# EAGLE schematic PoE_Board (EAGLE 7.3.0)
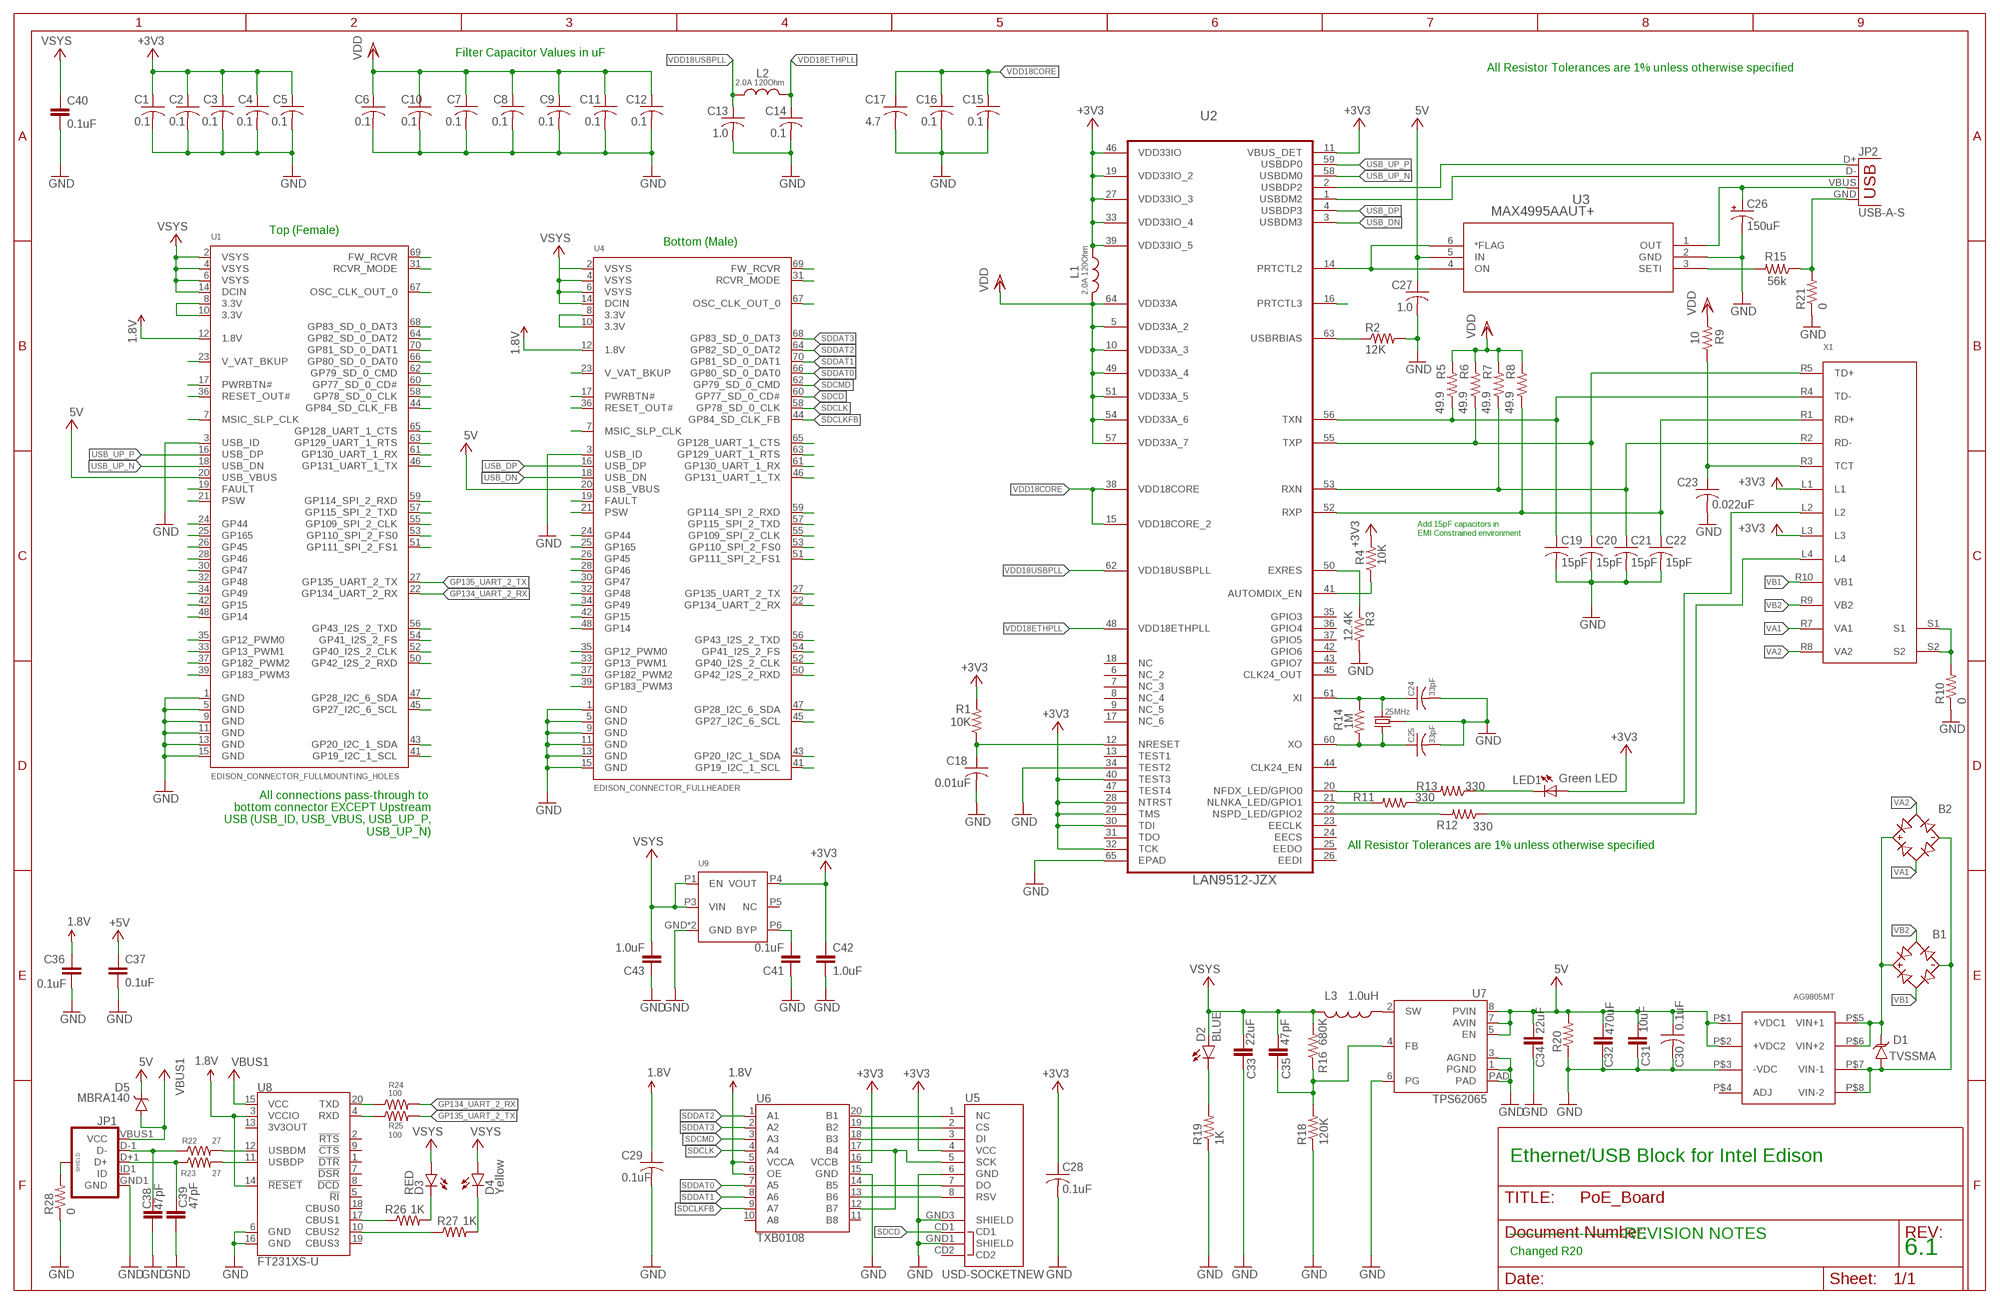
[diagram p0: schematic, sheet 1]

## Parts
AG9805MT  AG9800M  [AG9800M_SMT]
B1  DF1510S  [DFS]
B2  DF1510S  [DFS]
C1  0.1  C-USC0402K  [C0402K]
C2  0.1  C-USC0402K  [C0402K]
C3  0.1  C-USC0402K  [C0402K]
C4  0.1  C-USC0402K  [C0402K]
C5  0.1  C-USC0402K  [C0402K]
C6  0.1  C-USC0402K  [C0402K]
C7  0.1  C-USC0402K  [C0402K]
C8  0.1  C-USC0402K  [C0402K]
C9  0.1  C-USC0402K  [C0402K]
C10  0.1  C-USC0402K  [C0402K]
C11  0.1  C-USC0402K  [C0402K]
C12  0.1  C-USC0402K  [C0402K]
C13  1.0  C-USC0402K  [C0402K]
C14  0.1  C-USC0402K  [C0402K]
C15  0.1  C-USC0402K  [C0402K]
C16  0.1  C-USC0402K  [C0402K]
C17  4.7  C-USC0603K  [C0603K]
C18  0.01uF  C-USC0603K  [C0603K]
C19  15pF  C-USC0402  [C0402]
C20  15pF  C-USC0402  [C0402]
C21  15pF  C-USC0402  [C0402]
C22  15pF  C-USC0402  [C0402]
C23  0.022uF  C-USC0805  [C0805]
C24  33pF  C-USC0402  [C0402]
C25  33pF  C-USC0402  [C0402]
C26  150uF  CAP_POLE  [PANASONIC_E]
C27  1.0  C-USC0402K  [C0402K]
C28  0.1uF  C-USC0402  [C0402]
C29  0.1uF  C-USC0402  [C0402]
C30  0.1uF  C-USC0402  [C0402]
C31  10uF  4.7UF-16V-20%,+80%-(1206)  [1206-CAP]
C32  470uF  F12CAP  [16SVPE470M]
C33  22uF  47PF-50V-5%(0603)  [0603-CAP]
C34  22uF  47PF-50V-5%(0603)  [0603-CAP]
C35  47pF  47PF-50V-5%(0603)  [0603-CAP]
C36  0.1uF  0.1UF-16V(+-10%)(0402)  [0402-CAP]
C37  0.1uF  0.1UF-16V(+-10%)(0402)  [0402-CAP]
C38  47pF  47PF-50V-5%(0603)  [0603-CAP]
C39  47pF  47PF-50V-5%(0603)  [0603-CAP]
C40  0.1uF  0.1UF-16V(+-10%)(0402)  [0402-CAP]
C41  0.1uF  0.1UF-16V(+-10%)(0402)  [0402-CAP]
C42  1.0uF  1.0UF-16V-10%(0402)  [0402-CAP]
C43  1.0uF  1.0UF-16V-10%(0402)  [0402-CAP]
D1  TVSSMA  [SMA-DIODE]
D2  BLUE  LED-BLUE0603  [LED-0603]
D3  RED  LED-RED0603  [LED-0603]
D4  Yellow  LED-YELLOW0603  [LED-0603]
D5  MBRA140  DIODE-SCHOTTKY-MBRA140  [SMA-DIODE]
JP1  USB_MICROB_PLUGCONN-11752  [USB-B-MICRO-SMD_V03]
JP2  USB-A-S  [USB-A-S]
L1  2.0A 120Ohm  L-US0603  [L0603]
L2  2.0A 120Ohm  L-US0603  [L0603]
L3  1.0uH  INDUCTOR1210  [1210]
LED1  Green LED  LEDCHIP-LED0805  [CHIP-LED0805]
R1  10K  R-US_R0603  [R0603]
R2  12K  R-US_R0603  [R0603]
R3  12.4K  R-US_R0603  [R0603]
R4  10K  R-US_R0603  [R0603]
R5  49.9  R-US_R0402  [R0402]
R6  49.9  R-US_R0402  [R0402]
R7  49.9  R-US_R0402  [R0402]
R8  49.9  R-US_R0402  [R0402]
R9  10  R-US_R0402  [R0402]
R10  0  0OHM-1/10W-5%(0603)  [0603]
R11  330  R-US_R0402  [R0402]
R12  330  R-US_R0402  [R0402]
R13  330  R-US_R0402  [R0402]
R14  1M  R-US_R0402  [R0402]
R15  56k  R-US_R0603  [R0603]
R16  680K  RESISTOR0402  [0402-RES]
R18  120K  RESISTOR0402  [0402-RES]
R19  1K  1KOHM-1/10W-1%(0603)  [0603-RES]
R20  24OHM_1225  [R1225]
R21  0  0OHM-1/10W-5%(0603)  [0603]
R22  27  R-US_R0402  [R0402]
R23  27  R-US_R0402  [R0402]
R24  100  R-US_R0402  [R0402]
R25  100  R-US_R0402  [R0402]
R26  1K  R-US_R0402  [R0402]
R27  1K  R-US_R0402  [R0402]
R28  0  0OHM-1/10W-5%(0603)  [0603]
U1  EDISON_CONNECTOR_FULLMOUNTING_HOLES  [EDISON_DAUGHTER]
U2  LAN9512-JZX  [QFN50P900X900X100-65N]
U3  MAX4995AAUT+  [21-0058I]
U4  EDISON_CONNECTOR_FULLHEADER  [DF40C-70DP-0.4(51)]
U5  USD-SOCKETNEW  [MICRO-SD-SOCKET-PP]
U6  TXB0108  [UFDFN-20]
U7  TPS62065  [WSON-8-PAD]
U8  FT231XS-U  FT231XS  [SSOP20_L]
U9  MIC5353-XXYMT  [6-UFDFN]
U$1  25MHz  CRYSTAL-GROUNDED  [CRYSTAL-SMD-5X3]
X1  RB1-125BHQ1A  [RB1-125BHQ1A]

## Nets
1.8V: C29.1 C36.1 U1.12(1.8V) U4.12(1.8V) U6.5(VCCA) U6.6(OE) U8.3(VCCIO) U8.14(!RESET)
5V: AG9805MT.P$1(+VDC1) AG9805MT.P$2(+VDC2) C30.1 C31.1 C32.1 C34.1 R20.P$2 U7.5(EN) U7.7(AVIN) U7.8(PVIN)
+3V3: C1.1 C2.1 C3.1 C4.1 C5.1 C28.1 C42.1 L1.1 LED1.A R1.2 R4.2 U2.11(VBUS_DET) U2.19(VDD33IO_2) U2.27(VDD33IO_3) U2.28(NTRST) U2.29(TMS) U2.30(TDI) U2.32(TCK) U2.33(VDD33IO_4) U2.39(VDD33IO_5) U2.40(TEST3) U2.46(VDD33IO) U5.4(VCC) U6.16(VCCB) U9.P4(VOUT) X1.L1 X1.L3
+5V: C27.1 C37.1 D5.C U1.20(USB_VBUS) U3.5(IN) U4.20(USB_VBUS) ; supply symbol labelled 5V
CHASSGND: R10.2 X1.S1 X1.S2
DSUSB_N: JP2.D- U2.1(USBDM2)
DSUSB_P: JP2.D+ U2.2(USBDP2)
ED3.3V: U1.8(3.3V) U1.10(3.3V) U4.8(3.3V) U4.10(3.3V)
GND: AG9805MT.P$3(-VDC) C1.2 C2.2 C3.2 C4.2 C5.2 C6.2 C7.2 C8.2 C9.2 C10.2 C11.2 C12.2 C13.2 C14.2 C15.2 C16.2 C17.2 C18.2 C19.2 C20.2 C21.2 C22.2 C23.2 C24.2 C25.2 C26.- C27.2 C28.2 C29.2 C30.2 C31.2 C32.2 C33.2 C34.2 C36.2 C37.2 C38.2 C39.2 C40.2 C41.1 C42.2 C43.1 JP1.GND1(GND) R2.2 R3.2 R10.1 R18.1 R19.1 R20.P$1 R21.1 R28.1 U1.1(GND) U1.3(USB_ID) U1.5(GND) U1.9(GND) U1.11(GND) U1.13(GND) U1.15(GND) U2.34(TEST2) U2.65(EPAD) U3.2(GND) U4.1(GND) U4.3(USB_ID) U4.5(GND) U4.9(GND) U4.11(GND) U4.13(GND) U4.15(GND) U5.6(GND) U5.GND1(SHIELD) U5.GND3(SHIELD) U6.15(GND) U7.1(PGND) U7.3(AGND) U7.6(PG) U7.PAD U8.6(GND) U8.16(GND) U9.GND U9.P2(GND) U$1.2 U$1.4
GP134_UART_2_RX: R24.2 U1.22(GP134_UART_2_RX) U4.22(GP134_UART_2_RX)
GP135_UART_2_TX: R25.2 U1.27(GP135_UART_2_TX) U4.27(GP135_UART_2_TX)
N$2: U5.1(NC) U6.20(B1)
N$3: U2.16(PRTCTL3)
N$4: U5.2(CS) U6.19(B2)
N$5: U5.3(DI) U6.18(B3)
N$6: R2.1 U2.63(USBRBIAS)
N$7: C18.1 R1.1 U2.12(NRESET)
N$8: R3.1 U2.50(EXRES)
N$9: R4.1 U2.41(AUTOMDIX_EN)
N$10: C23.1 R9.1 X1.R3(TCT)
N$11: U5.5(SCK) U6.12(B7) U6.17(B4)
N$12: U5.7(DO) U6.14(B5)
N$13: U5.8(RSV) U6.13(B6)
N$14: L3.1 U7.2(SW)
N$15: R11.2 U2.21(NLNKA_LED/GPIO1)
N$16: R11.1 X1.L2
N$17: R12.1 X1.L4
N$18: R12.2 U2.22(NSPD_LED/GPIO2)
N$19: LED1.C R13.1
N$20: R13.2 U2.20(NFDX_LED/GPIO0)
N$21: C24.1 R14.1 U2.61(XI) U$1.1
N$22: C25.1 R14.2 U2.60(XO) U$1.3
N$23: U2.14(PRTCTL2) U3.4(ON) U3.6(*FLAG)
N$24: AG9805MT.P$5(VIN+1) AG9805MT.P$6(VIN+2) B1.+ B2.+ D1.C
N$25: C26.+ JP2.VBUS U3.1(OUT)
N$26: R15.2 U3.3(SETI)
N$27: D2.C R19.2
N$28: JP2.GND R15.1 R21.2
N$29: C38.1 JP1.D-1(D-) R22.1
N$30: C39.1 JP1.D+1(D+) R23.1
N$31: R22.2 U8.12(USBDM)
N$32: JP1.SHIELD1(SHIELD) JP1.SHIELD2(SHIELD) JP1.SHIELD3(SHIELD) R28.2
N$33: AG9805MT.P$7(VIN-1) AG9805MT.P$8(VIN-2) B1.- B2.- D1.A
N$34: R23.2 U8.11(USBDP)
N$35: R24.1 U8.20(TXD)
N$36: R25.1 U8.4(RXD)
N$37: C35.2 R16.1 R18.2 U7.4(FB)
N$38: C41.2 U9.P6(BYP)
N$39: R27.1 U8.10(CBUS2)
N$40: R26.1 U8.17(CBUS1)
N$41: D3.C R26.2
N$42: D4.C R27.2
P7: U1.7(MSIC_SLP_CLK) U4.7(MSIC_SLP_CLK)
P17: U1.17(PWRBTN#) U4.17(PWRBTN#)
P19: U1.19(FAULT) U4.19(FAULT)
P21: U1.21(PSW) U4.21(PSW)
P23: U1.23(V_VAT_BKUP) U4.23(V_VAT_BKUP)
P24: U1.24(GP44) U4.24(GP44)
P25: U1.25(GP165) U4.25(GP165)
P26: U1.26(GP45) U4.26(GP45)
P28: U1.28(GP46) U4.28(GP46)
P30: U1.30(GP47) U4.30(GP47)
P31: U1.31(RCVR_MODE) U4.31(RCVR_MODE)
P32: U1.32(GP48) U4.32(GP48)
P33: U1.33(GP13_PWM1) U4.33(GP13_PWM1)
P34: U1.34(GP49) U4.34(GP49)
P35: U1.35(GP12_PWM0) U4.35(GP12_PWM0)
P36: U1.36(RESET_OUT#) U4.36(RESET_OUT#)
P37: U1.37(GP182_PWM2) U4.37(GP182_PWM2)
P39: U1.39(GP183_PWM3) U4.39(GP183_PWM3)
P41: U1.41(GP19_I2C_1_SCL) U4.41(GP19_I2C_1_SCL)
P42: U1.42(GP15) U4.42(GP15)
P43: U1.43(GP20_I2C_1_SDA) U4.43(GP20_I2C_1_SDA)
P45: U1.45(GP27_I2C_6_SCL) U4.45(GP27_I2C_6_SCL)
P46: U1.46(GP131_UART_1_TX) U4.46(GP131_UART_1_TX)
P47: U1.47(GP28_I2C_6_SDA) U4.47(GP28_I2C_6_SDA)
P48: U1.48(GP14) U4.48(GP14)
P50: U1.50(GP42_I2S_2_RXD) U4.50(GP42_I2S_2_RXD)
P51: U1.51(GP111_SPI_2_FS1) U4.51(GP111_SPI_2_FS1)
P52: U1.52(GP40_I2S_2_CLK) U4.52(GP40_I2S_2_CLK)
P53: U1.53(GP110_SPI_2_FS0) U4.53(GP110_SPI_2_FS0)
P54: U1.54(GP41_I2S_2_FS) U4.54(GP41_I2S_2_FS)
P55: U1.55(GP109_SPI_2_CLK) U4.55(GP109_SPI_2_CLK)
P56: U1.56(GP43_I2S_2_TXD) U4.56(GP43_I2S_2_TXD)
P57: U1.57(GP115_SPI_2_TXD) U4.57(GP115_SPI_2_TXD)
P59: U1.59(GP114_SPI_2_RXD) U4.59(GP114_SPI_2_RXD)
P61: U1.61(GP130_UART_1_RX) U4.61(GP130_UART_1_RX)
P63: U1.63(GP129_UART_1_RTS) U4.63(GP129_UART_1_RTS)
P65: U1.65(GP128_UART_1_CTS) U4.65(GP128_UART_1_CTS)
P67: U1.67(OSC_CLK_OUT_0) U4.67(OSC_CLK_OUT_0)
P69: U1.69(FW_RCVR) U4.69(FW_RCVR)
RX_N: C22.1 R8.1 U2.52(RXP) X1.R1(RD+)
RX_P: C21.1 R7.1 U2.53(RXN) X1.R2(RD-)
SDCD: U1.60(GP77_SD_0_CD#) U4.60(GP77_SD_0_CD#) U5.CD1
SDCLK: U1.58(GP78_SD_0_CLK) U4.58(GP78_SD_0_CLK) U6.4(A4)
SDCLKFB: U1.44(GP84_SD_CLK_FB) U4.44(GP84_SD_CLK_FB) U6.9(A7)
SDCMD: U1.62(GP79_SD_0_CMD) U4.62(GP79_SD_0_CMD) U6.3(A3)
SDDAT0: U1.66(GP80_SD_0_DAT0) U4.66(GP80_SD_0_DAT0) U6.7(A5)
SDDAT1: U1.70(GP81_SD_0_DAT1) U4.70(GP81_SD_0_DAT1) U6.8(A6)
SDDAT2: U1.64(GP82_SD_0_DAT2) U4.64(GP82_SD_0_DAT2) U6.1(A1)
SDDAT3: U1.68(GP83_SD_0_DAT3) U4.68(GP83_SD_0_DAT3) U6.2(A2)
TX_N: C19.1 R5.1 U2.56(TXN) X1.R4(TD-)
TX_P: C20.1 R6.1 U2.55(TXP) X1.R5(TD+)
USB_DN: U2.3(USBDM3) U4.18(USB_DN)
USB_DP: U2.4(USBDP3) U4.16(USB_DP)
USB_UP_N: U1.18(USB_DN) U2.58(USBDM0)
USB_UP_P: U1.16(USB_DP) U2.59(USBDP0)
VA1: B2.~@1(AC1) X1.R7(VA1)
VA2: B2.~@2(AC2) X1.R8(VA2)
VB1: B1.~@1(AC1) X1.R10(VB1)
VB2: B1.~@2(AC2) X1.R9(VB2)
VBUS1: D5.A JP1.VBUS1(VCC) U8.15(VCC)
VCC: C40.1 C43.2 U9.P1(EN) U9.P3(VIN) ; supply symbol labelled VSYS
VDD18CORE: C15.1 C16.1 C17.1 U2.15(VDD18CORE_2) U2.38(VDD18CORE)
VDD18ETHPLL: C14.1 L2.2 U2.48(VDD18ETHPLL)
VDD18USBPLL: C13.1 L2.1 U2.62(VDD18USBPLL)
VDD33A: C6.1 C7.1 C8.1 C9.1 C10.1 C11.1 C12.1 L1.2 R5.2 R6.2 R7.2 R8.2 R9.2 U2.5(VDD33A_2) U2.10(VDD33A_3) U2.49(VDD33A_4) U2.51(VDD33A_5) U2.54(VDD33A_6) U2.57(VDD33A_7) U2.64(VDD33A) ; supply symbol labelled VDD
VSYS: C33.1 C35.1 D2.A D3.A D4.A L3.2 R16.2 U1.2(VSYS) U1.4(VSYS) U1.6(VSYS) U1.14(DCIN) U4.2(VSYS) U4.4(VSYS) U4.6(VSYS) U4.14(DCIN)
Unconnected: AG9805MT.P$4(ADJ) JP1.ID1(ID) U2.6(NC_2) U2.7(NC_3) U2.8(NC_4) U2.9(NC_5) U2.13(TEST1) U2.17(NC_6) U2.18(NC) U2.23(EECLK) U2.24(EECS) U2.25(EEDO) U2.26(EEDI) U2.31(TDO) U2.35(GPIO3) U2.36(GPIO4) U2.37(GPIO5) U2.42(GPIO6) U2.43(GPIO7) U2.44(CLK24_EN) U2.45(CLK24_OUT) U2.47(TEST4) U5.CD2 U6.10(A8) U6.11(B8) U8.1(!DTR) U8.2(!RTS) U8.5(!RI) U8.7(!DSR) U8.8(!DCD) U8.9(!CTS) U8.13(3V3OUT) U8.18(CBUS0) U8.19(CBUS3) U9.P5(NC)

## Notes on the sheet
- Filter Capacitor Values in uF
- All Resistor Tolerances are 1% unless otherwise specified
- Top (Female)
- Bottom (Male)
- Add 15pF capacitors in 
  EMI Constrained environment
- All connections pass-through to 
  bottom connector EXCEPT Upstream
  USB (USB_ID, USB_VBUS, USB_UP_P,
  USB_UP_N)
- All Resistor Tolerances are 1% unless otherwise specified
- Ethernet/USB Block for Intel Edison
- -----------------------REVISION NOTES
- Changed R20 | 6.1

## Library data of the parts
AG9805MT = PoEdev:AG9800M
B1 B2 = PoEdev:DF1510S
C1-C22 C24 C25 C27-C30 = rcl:C-US: CAPACITOR, American symbol
C23 = resistor:C-US: CAPACITOR, American symbol
C26 = SparkFun-Capacitors:CAP_POL: Capacitor Polarized These are standard SMD and PTH capacitors. Normally 10uF, 47uF, and 100uF in electrolytic and tantalum varieties. Always verify the external diameter of the through hole cap, it varies with capacity, voltage, and manufacturer. The EIA devices should be standard.
C31 = SparkFun-Capacitors:4.7UF-16V-20%,+80%-(1206): CAP-10300; PROD_ID: CAP-10300; VALUE: 4.7uF
C32 = PoEdev:F12CAP
C33 C34 = SparkFun-Capacitors:47PF-50V-5%(0603): CAP-08913; PROD_ID: CAP-08913; VALUE: 47pF
C35 C38 C39 = SparkFun-Capacitors:47PF-50V-5%(0603): CAP-08913; PROD_ID: CAP-08913
C36 C37 C40 C41 = SparkFun-Capacitors:0.1UF-16V(+-10%)(0402); PROD_ID: CAP-12416
C42 C43 = SparkFun-Capacitors:1.0UF-16V-10%(0402); PROD_ID: CAP-12417
D1 = SparkFun-DiscreteSemi:TVS: Transient voltage suppressor- prevents ESD on inputs.
D2 = SparkFun-LED:LED-BLUE: Blue LEDs for production use Various blue LEDs stocked by SparkFun production 0603 - DIO-08575 Rebel - DIO-09553 1206 - DIO-09911; PROD_ID: DIO-08575
D3 = SparkFun-LED:LED-RED: Assorted Red LEDs LilyPad 1206- DIO-09912 1206- DIO-00809 0603- DIO-00819 "SMART" means more efficient and expensive; PROD_ID: DIO-00819
D4 = SparkFun-LED:LED-YELLOW: Yellow SMD LEDs LilyPad 1206- DIO-09909 0603- DIO-09003 "SMART" means more efficient and expensive; PROD_ID: DIO-09003
D5 = SparkFun-DiscreteSemi:DIODE-SCHOTTKY: Schottky diodes in SFE's production catalog BAT20J 1A 23V 0.62Vf RB751 120mA 40V 0.37Vf PMEG4005EJ 0.5A 40V 0.42Vf MBRA140 1A 40V 0.5Vf B340A 3A 40V SMA; PROD_ID: DIO-08053
JP1 = SparkFun-Connectors:USB_MICROB_PLUG: USB Micro-B connectors Some male, some female. Watch your step!; PROD_ID: CONN-11752
JP2 = SparkFun-Connectors:USB: USB Connectors USB-B-PTH is fully proven SKU : PRT-00139/CONN-08278 USB-miniB is fully proven SKU : PRT-00587 USB-A-PCB is untested. USB-A-H is throughly reviewed, but untested. Spark Fun Electronics SKU : PRT-00437 USB-B-SMT is throughly reviewed, but untested. Needs silkscreen touching up. USB-A-S has not been used/tested USB-MB-H has not been used/tested USB-MICROB has been used. CONN-09505
L1 L2 = murata-inductors:L-US
L3 = SparkFun-Passives:INDUCTOR: Inductors Basic Inductor/Choke - 0603 and 1206. Footprints are not proven and vary greatly between part numbers. INDUCTOR POWER 3.3UH 4.0A SMD 0.197" L x 0.197" W x 0.177" H (5.00mm x 5.00mm x 4.50mm)
LED1 = led:LED: LED OSRAM: - CHIPLED LG R971, LG N971, LY N971, LG Q971, LY Q971, LO R971, LY R971 LH N974, LH R974 LS Q976, LO Q976, LY Q976 LO Q996 - Hyper CHIPLED LW Q18S LB Q993, LB Q99A, LB R99A - SideLED LS A670, LO A670, LY A670, LG A670, LP A670 LB A673, LV A673, LT A673, LW A673 LH A674 LY A675 LS A676, LA A676, LO A676, LY A676, LW A676 LS A679, LY A679, LG A679 - Hyper Micro SIDELED® LS Y876, LA Y876, LO Y876, LY Y876 LT Y87S - SmartLED LW L88C, LW L88S LB L89C, LB L89S, LG L890 LS L89K, LO L89K, LY L89K LS L896, LA L896, LO L896, LY L896 - TOPLED LS T670, LO T670, LY T670, LG T670, LP T670 LSG T670, LSP T670, LSY T670, LOP T670, LYG T670 LG T671, LOG T671, LSG T671 LB T673, LV T673, LT T673, LW T673 LH T674 LS T676, LA T676, LO T676, LY T676, LB T676, LH T676, LSB T676, LW T676 LB T67C, LV T67C, LT T67C, LS T67K, LO T67K, LY T67K, LW E67C LS E67B, LA E67B, LO E67B, LY E67B, LB E67C, LV E67C, LT E67C LW T67C LS T679, LY T679, LG T679 LS T770, LO T770, LY T770, LG T770, LP T770 LB T773, LV T773, LT T773, LW T773 LH T774 LS E675, LA E675, LY E675, LS T675 LS T776, LA T776, LO T776, LY T776, LB T776 LHGB T686 LT T68C, LB T68C - Hyper Mini TOPLED® LB M676 - Mini TOPLED Santana® LG M470 LS M47K, LO M47K, LY M47K Source: http://www.osram.convergy.de LUXEON: - LUMILED® LXK2-PW12-R00, LXK2-PW12-S00, LXK2-PW14-U00, LXK2-PW14-V00 LXK2-PM12-R00, LXK2-PM12-S00, LXK2-PM14-U00 LXK2-PE12-Q00, LXK2-PE12-R00, LXK2-PE12-S00, LXK2-PE14-T00, LXK2-PE14-U00 LXK2-PB12-K00, LXK2-PB12-L00, LXK2-PB12-M00, LXK2-PB14-N00, LXK2-PB14-P00, LXK2-PB14-Q00 LXK2-PR12-L00, LXK2-PR12-M00, LXK2-PR14-Q00, LXK2-PR14-R00 LXK2-PD12-Q00, LXK2-PD12-R00, LXK2-PD12-S00 LXK2-PH12-R00, LXK2-PH12-S00 LXK2-PL12-P00, LXK2-PL12-Q00, LXK2-PL12-R00 Source: www.luxeon.com KINGBRIGHT: KA-3528ASYC Source: www.kingbright.com
R1-R9 R11-R14 R22-R27 = resistor:R-US_: RESISTOR, American symbol
R10 R21 R28 = SparkFun-Resistors:0OHM-1/10W-5%(0603): RES-08609; PROD_ID: RES-08609
R15 = rcl:R-US_: RESISTOR, American symbol
R16 R18 = SparkFun-Resistors:RESISTOR: Resistor Basic schematic elements and footprints for 0603, 1206, and PTH resistors.
R19 = SparkFun-Resistors:1KOHM-1/10W-1%(0603): RES-07856; PROD_ID: RES-07856
R20 = PoEdev:24OHM_1225
U1 U4 = Edison:EDISON_CONNECTOR_FULL
U2 = Lan9512:LAN9512-JZX: IC, USB2 - ENET CNTRL 2-PORT HUB, 64VQFN; MPN: LAN9512-JZX; OC_FARNELL: 2292586; OC_NEWARK: 66W1988; PACKAGE: 64VQFN; SUPPLIER: Microchip
U3 = MAX4995:MAX4995AAUT+: Programmable current-limit switch; MANUFACTURER_PART_NUMBER: max4995aaut+; VENDOR: MAXIM
U5 = SparkFun-Connectors:USD-SOCKET: microSD Socket Push-push type uSD socket. Schematic element and footprint production proven. Spark Fun Electronics SKU : PRT-00127. tDoc lines correctly indicate media card edge positions when inserting (unlocked, locked, depressed). NOTE: CD1 and CD2 are connected internally; PROD_ID: CONN-07820
U6 = SparkFun-DigitalIC:TXB0108: 8-Bit Bi-Directional Level Shifter 1.2V-3.6V (VCCA) to 1.65V-5.5V (VCCB) bi-directional level shifter with auto direction sensing. Max data rate - VCCA 1.2V: 20Mbps (50ns), VCCA 3.3V: 100Mbps (10ns) Digikey: 296-27217-1-ND (20-UFDFN) IC-12292; PROD_ID: IC-12292
U7 = SparkFun-PowerIC:TPS62065: TPS62065 DC/DC step-Down regulator.; PROD_ID: IC-12273
U8 = SparkFun-DigitalIC:FT231X: FTDI FT231X Full Speed USB to Full-handshake UART This USB2.0 Full Speed IC offers a compact bridge to full handshake UART interfaces. The device is a UART, capable of operating up to 3MBaud, with low power consumption (8mA). The FT231X includes the complete FT-X series feature set and enables USB to be added into a system design quickly and easily over a UART interface.; PROD_ID: IC-11524; VALUE: FTS31XS-U
U9 = PoEdev:MIC5353-XXYMT
U$1 = SparkFun-FreqCtrl:CRYSTAL-GROUNDED
X1 = PoEdev:RB1-125BHQ1A